# EAGLE design openSX70_MEROEC_V7-9C_20200625-TCS3200 (EAGLE 9.6.1)
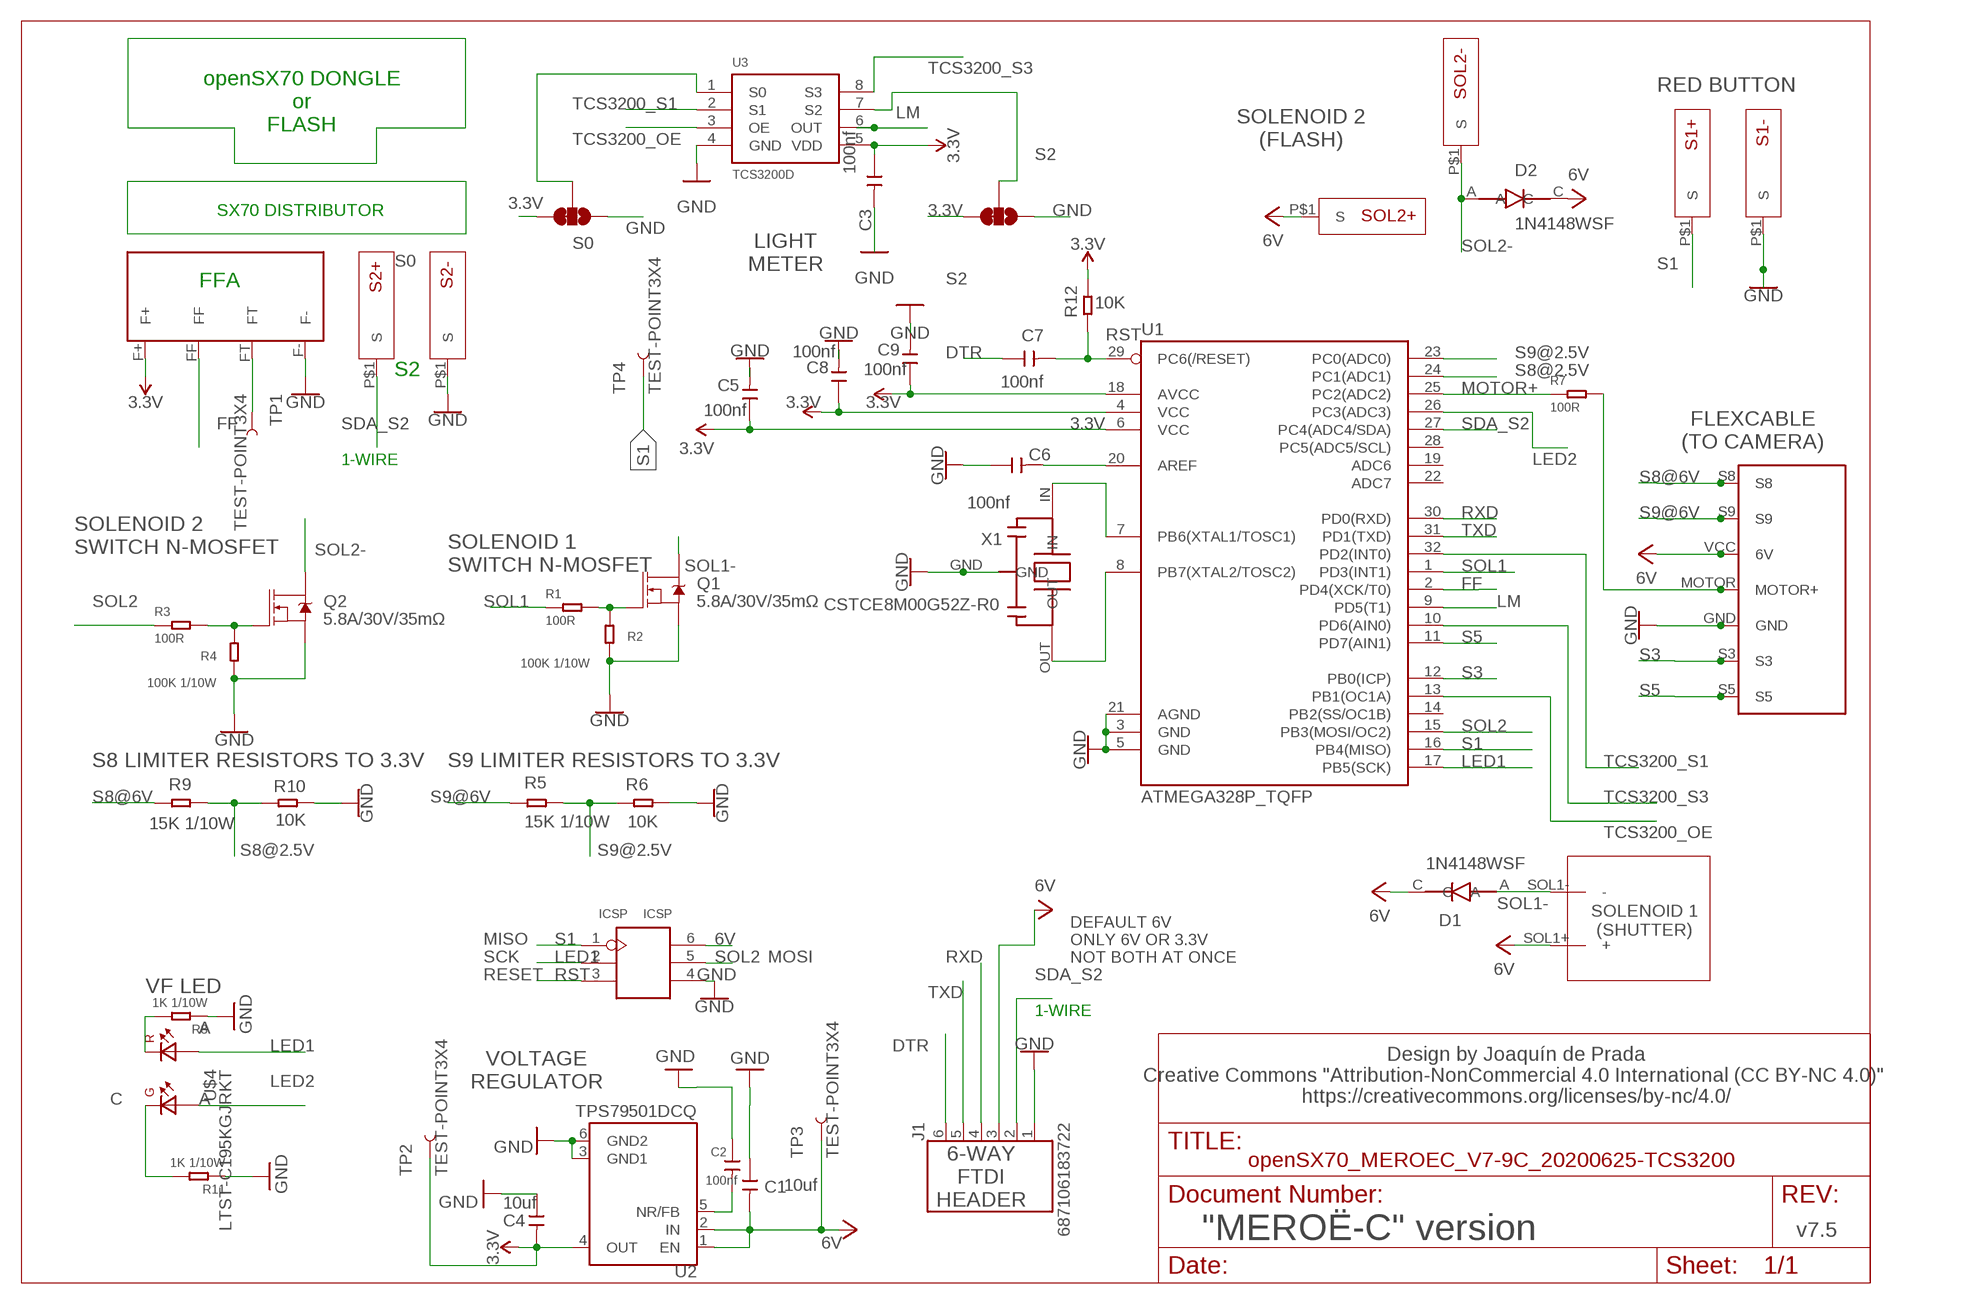
[diagram p0: schematic, sheet 1]

## Parts
C1  10uf  CERAMIC-10UF-10V-10%-X5R(0603)  [C0603]
C2  100nf  CERAMIC-100NF-50V-10%-X7R(0603)  [C0603]
C3  100nf  CERAMIC-100NF-50V-10%-X7R(0603)  [C0603]
C4  10uf  CERAMIC-10UF-10V-10%-X5R(0603)  [C0603]
C5  100nf  CERAMIC-100NF-50V-10%-X7R(0603)  [C0603]
C6  100nf  CERAMIC-100NF-50V-10%-X7R(0603)  [C0603]
C7  100nf  CERAMIC-100NF-50V-10%-X7R(0603)  [C0603]
C8  100nf  CERAMIC-100NF-50V-10%-X7R(0603)  [C0603]
C9  100nf  CERAMIC-100NF-50V-10%-X7R(0603)  [C0603]
D1  1N4148WSF  1N4148WS  [SODFL2512X100N]
D2  1N4148WSF  1N4148WS  [SODFL2512X100N]
ICSP  ICSP  [H2X3-2.54]
J1  687106183722  [687106183722]
Q1  5.8A/30V/35mΩ  MOSFET-NCH-AO3404A  [SOT23-3]
Q2  5.8A/30V/35mΩ  MOSFET-NCH-AO3404A  [SOT23-3]
R1  100R  SMD-RES-100R-5%-1/10W(0603)  [R0603]
R2  100K 1/10W  SMD-RES-100K-5%-1/10W(0603)  [R0603]
R3  100R  SMD-RES-100R-5%-1/10W(0603)  [R0603]
R4  100K 1/10W  SMD-RES-100K-5%-1/10W(0603)  [R0603]
R5  15K 1/10W  SMD-RES-15K-1%-1/10W(0603)  [R0603]
R6  10K  SMD-RES-10K-1%-1/10W(0603)  [R0603]
R7  100R  SMD-RES-100R-5%-1/10W(0603)  [R0603]
R8  1K 1/10W  SMD-RES-1K-5%-1/10W(0603)  [R0603]
R9  15K 1/10W  SMD-RES-15K-1%-1/10W(0603)  [R0603]
R10  10K  SMD-RES-10K-1%-1/10W(0603)  [R0603]
R11  1K 1/10W  SMD-RES-1K-5%-1/10W(0603)  [R0603]
R12  10K  SMD-RES-10K-1%-1/10W(0603)  [R0603]
S0  S0  JUMPER-SMT_3_1-NC_TRACE_SILK  [SMT-JUMPER_3_1-NC_TRACE_SILK]
S1+  SX70-S-PAD-NEW  [SX70-S-PAD2]
S1-  SX70-S-PAD-NEW  [SX70-S-PAD2]
S2  S2  JUMPER-SMT_3_1-NC_TRACE_SILK  [SMT-JUMPER_3_1-NC_TRACE_SILK]
S2+  SX70-S-PAD-NEW  [SX70-S-PAD2]
S2-  SX70-S-PAD-NEW  [SX70-S-PAD2]
SOL1  SX70-SOLENOID1-2PADS  [SX70-SOLENOID1-2]
SOL2+  SX70-S-PAD-NEW  [SX70-S-PAD2]
SOL2-  SX70-S-PAD-NEW  [SX70-S-PAD2]
TP1  TEST-POINT3X4  [PAD.03X.04]
TP2  TEST-POINT3X4  [PAD.03X.04]
TP3  TEST-POINT3X4  [PAD.03X.04]
TP4  TEST-POINT3X4  [PAD.03X.04]
U1  ATMEGA328P_TQFP  [TQFP32-08]
U2  TPS79501DCQ  [SOT127P706X180-6N]
U3  TCS3200D  [SOIC8]
U$1  SX70-7-PAD  [SX70-7-PAD-PROPER]
U$2  FFA  SX70-FFA-PAD  [FFA-PAD-PACKAGE]
U$4  LTST-C195KGJRKT  [LTST-BILED-15X16]
X1  CSTCE8M00G52Z-R0  CSTCE16M0V53-R0  [CFP95P160X100-3N]

## Nets
3.3V: C3.1 C4.2 C5.1 C8.1 C9.1 R12.2 S0.3 S2.3 TP2.P$1 U1.4(VCC) U1.6(VCC) U1.18(AVCC) U2.4(OUT) U3.5(VDD) U$2.F+
6V: C1.2 D1.C D2.C ICSP.6(VCC) J1.3 SOL1.SOL1+(+) SOL2+.P$1(S) TP3.P$1 U2.1(EN) U2.2(IN) U$1.VCC(6V)
DTR: C7.1 J1.6
FF: U1.2(PD4(XCK/T0)) U$2.FF
GND: C1.1 C2.1 C3.2 C4.1 C5.2 C6.1 C8.2 C9.2 ICSP.4(GND) J1.1 Q1.2(S) Q2.2(S) R2.1 R4.1 R6.2 R8.1 R10.2 R11.1 S0.1 S1-.P$1(S) S2-.P$1(S) S2.1 U1.3(GND) U1.5(GND) U1.21(AGND) U2.3(GND1) U2.6(GND2) U3.4(GND) U$1.GND U$2.F- X1.GND
LED1: ICSP.2(SCK) U1.17(PB5(SCK)) U$4.P$2(A2)
LED2: U1.26(PC3(ADC3)) U$4.P$1(A1)
LM: U1.9(PD5(T1)) U3.6(OUT)
MOTOR+: R7.1 U1.25(PC2(ADC2))
MOTOR-HEADER: R7.2 U$1.MOTOR(MOTOR+)
N$1: Q1.1(G) R1.2 R2.2
N$2: C6.2 U1.20(AREF)
N$3: Q2.1(G) R3.2 R4.2
N$4: U1.7(PB6(XTAL1/TOSC1)) X1.IN
N$5: TP1.P$1 U$2.FT
N$6: U1.8(PB7(XTAL2/TOSC2)) X1.OUT
N$7: S0.2 U3.1(S0)
N$8: S2.2 U3.7(S2)
N$9: R8.2 U$4.P$4(K2)
N$10: C2.2 U2.5(NR/FB)
N$11: R11.2 U$4.P$3(K1)
RST: C7.2 ICSP.3(RST) R12.1 U1.29(PC6(/RESET))
RXD: J1.4 U1.30(PD0(RXD))
S1: ICSP.1(MISO) S1+.P$1(S) TP4.P$1 U1.16(PB4(MISO))
S3: U1.12(PB0(ICP)) U$1.S3
S5: U1.11(PD7(AIN1)) U$1.S5
S8@2.5V: R9.2 R10.1 U1.24(PC1(ADC1))
S8@6V: R9.1 U$1.S8
S9@2.5V: R5.2 R6.1 U1.23(PC0(ADC0))
S9@6V: R5.1 U$1.S9
SDA_S2: J1.2 S2+.P$1(S) U1.27(PC4(ADC4/SDA))
SOL1: R1.1 U1.1(PD3(INT1))
SOL1-: D1.A Q1.3(D) SOL1.SOL1-(-)
SOL2: ICSP.5(MOSI) R3.1 U1.15(PB3(MOSI/OC2))
SOL2-: D2.A Q2.3(D) SOL2-.P$1(S)
TCS3200_OE: U1.13(PB1(OC1A)) U3.3(OE)
TCS3200_S1: U1.32(PD2(INT0)) U3.2(S1)
TCS3200_S3: U1.10(PD6(AIN0)) U3.8(S3)
TXD: J1.5 U1.31(PD1(TXD))
Unconnected: U1.14(PB2(SS/OC1B)) U1.19(ADC6) U1.22(ADC7) U1.28(PC5(ADC5/SCL))

## Notes on the sheet
- RED BUTTON
- openSX70 DONGLE
  or
  FLASH
- SOLENOID 2
  (FLASH)
- SX70 DISTRIBUTOR
- LIGHT
  METER
- FFA
- S2
- FLEXCABLE
  (TO CAMERA)
- 1-WIRE
- SOLENOID 2
  SWITCH N-MOSFET
- SOLENOID 1
  SWITCH N-MOSFET
- S8 LIMITER RESISTORS TO 3.3V | S9 LIMITER RESISTORS TO 3.3V
- SOLENOID 1
  (SHUTTER)
- MISO
- SCK | MOSI
- RESET
- DEFAULT 6V
  ONLY 6V OR 3.3V
  NOT BOTH AT ONCE
- VF LED | 1-WIRE
- A
- VOLTAGE
  REGULATOR
- Design by Joaquín de Prada
  Creative Commons "Attribution-NonCommercial 4.0 International (CC BY-NC 4.0)" 
  https://creativecommons.org/licenses/by-nc/4.0/
- C | A
- 6-WAY
  FTDI
  HEADER
- v7.5
- "MEROË-C" version

## Library data of the parts
C1 C4 = Seeed-Capacitor:CERAMIC-10UF-10V-10%-X5R(0603): 302010103; MPN: CC0603KRX5R6BB106
C2 C3 C5-C9 = Seeed-Capacitor:CERAMIC-100NF-50V-10%-X7R(0603): 302010138; MPN: CC0603KRX7R9BB104
D1 D2 = Common-Parts-Library-Eagle:1N4148WS: 1N4148WS Series 75 V 300 mA Surface Mount Small Signal Diodes - SOD-323F; MANUFACTURER: Fairchild Semiconductor
ICSP = openSX70:ICSP
J1 = 687106183722:687106183722: 687106183722 WR-FPC 0.50mm SMT Horizontal Bottom Contact - Low Profile <http://katalog.we-online.de/media/images/v2/Family_WR-FPC_6871xx183722.jpg> Details see: http://katalog.we-online.de/en/em/FPC_0_5_SMT_ZIF_HORIZONTAL_BOTTOM_CONTACT_LOW_PROFILE_6871xx183722 Created by Yingchun,shan 2016 (C) Wurth Elektronik; AVAILABILITY: Good; DESCRIPTION: CONN FFC BTM 6POS 0.5MM SMD R/A; MF: Wurth Electronics; MP: 687106183722; PACKAGE: None; PRICE: 1.21 USD
Q1 Q2 = openSX70:MOSFET-NCH: N-channel MOSFETs Voltage controlled devices that allow control of high current outputs. SparkFun Products: SparkFun OpenScale <https://www.sparkfun.com/products/13261> SparkFun Digital Sandbox <https://www.sparkfun.com/products/12651> SparkFun Monster Moto Shield <https://www.sparkfun.com/products/10182> SparkFun MOSFET Power Controller <https://www.sparkfun.com/products/11214>; PROD_ID: TRANS-12988
R1 R3 R7 = Seeed-Resistor:SMD-RES-100R-5%-1/10W(0603): 301010090; MPN: RC0603JR-07100RL
R2 R4 = Seeed-Resistor:SMD-RES-100K-5%-1/10W(0603): 301010089; MPN: RC0603JR-07100KL
R5 R9 = Seeed-Resistor:SMD-RES-15K-1%-1/10W(0603): 301010241; MPN: RC0603FR-0715KL
R6 R10 R12 = Seeed-Resistor:SMD-RES-10K-1%-1/10W(0603): 301010299; MPN: RC0603FR-0710KL
R8 R11 = Seeed-Resistor:SMD-RES-1K-5%-1/10W(0603): 301010291; MPN: RC0603JR-071KL
S0 S2 = SparkFun-Jumpers:JUMPER-SMT_3_1-NC_TRACE: Normally closed trace jumper (1 of 2 connections) This jumper has a trace between two pads so it's normally closed (NC). The other connection is normally open (NO). Use a razor knife to open the connection. For best results follow the IPC guidelines for cutting traces: Cutout at least 0.063 mm (0.005 in). Remove all loose material to clean up the cut area. Seal the cut with an approved epoxy. Reapply solder to reclose the connection, or to close the NO connection.
S1+ S1- S2+ S2- SOL2+ SOL2- = openSX70:SX70-S-PAD-NEW
SOL1 = openSX70:SX70-SOLENOID1-2PADS
TP1-TP4 = SparkFun-Connectors:TEST-POINT: SparkFun Test Points Bare copper test points for troubleshooting or In-Circuit-Testing. These are used by our Production team for verifying production board runs using pogo-pins on test beds. SparkFun Products: SparkFun LSM9DS1 Breakout <https://www.sparkfun.com/products/13284> SparkFun PSOC <https://www.sparkfun.com/products/13714> SparkFun Load Cell Amplifier <https://www.sparkfun.com/products/13879>
U1 = openSX70:ATMEGA328P_TQFP: Popular 328P in QFP Storefront component: ATmega328 - TQFP <https://www.sparkfun.com/products/13448> (COM-13448) Datasheet <http://www.sparkfun.com/datasheets/Components/SMD/ATMega328.pdf> SparkFun Products SparkFun RedBoard - Programmed with Arduino <https://www.sparkfun.com/products/12757> (DEV-12757) Arduino Pro Mini 328 - 5V/16MHz <https://www.sparkfun.com/products/11113> (DEV-11113) Arduino Pro Mini 328 - 3.3V/8MHz <https://www.sparkfun.com/products/11114> (DEV-11114) SparkFun OpenLog <https://www.sparkfun.com/products/13712> (DEV-13712) SparkFun MicroView - OLED Arduino Module <https://www.sparkfun.com/products/12923> (DEV-12923) SparkFun Digital Sandbox <https://www.sparkfun.com/products/12651> (DEV-12651) SparkFun PicoBoard <https://www.sparkfun.com/products/11888> (WIG-11888) Arduino Fio <https://www.sparkfun.com/products/10116> (DEV-10116) LilyPad Arduino 328 Main Board <https://www.sparkfun.com/products/13342> (DEV-13342) SparkFun RedStick <https://www.sparkfun.com/products/13741> (DEV-13741) LilyPad MP3 <https://www.sparkfun.com/products/11013> (DEV-11013) LilyPad Arduino SimpleSnap <https://www.sparkfun.com/products/10941> (DEV-10941) SparkFun Stepoko <https://www.sparkfun.com/products/13899> (ROB-13899) SparkFun Geiger Counter <https://www.sparkfun.com/products/11345> (SEN-11345) SparkFun EL Sequencer <https://www.sparkfun.com/products/12781> (COM-12781) Arduino Pro 328 - 5V/16MHz <https://www.sparkfun.com/products/10915> (DEV-10915) CryptoCape <https://www.sparkfun.com/products/12773> (DEV-12773) SparkFun IR Thermometer Evaluation Board - MLX90614 <https://www.sparkfun.com/products/10740> (SEN-10740) SparkFun RedBot Mainboard <https://www.sparkfun.com/products/12097> (ROB-12097) Arduino Pro 328 - 3.3V/8MHz <https://www.sparkfun.com/products/10914> (DEV-10914) SparkFun Block for Intel® Edison - Arduino <https://www.sparkfun.com/products/13036> (DEV-13036) SparkFun Simon Says - Surface Mount Soldering Kit <https://www.sparkfun.com/products/10935> (KIT-10935) SparkFun 7-Segment Serial Display - Red <https://www.sparkfun.com/products/11441> (COM-11441) SparkFun 7-Segment Serial Display - White <https://www.sparkfun.com/products/11629> (COM-11629) SparkFun 7-Segment Serial Display - Yellow <https://www.sparkfun.com/products/11443> (COM-11443) SparkFun 7-Segment Serial Display - Kelly Green <https://www.sparkfun.com/products/11440> (COM-11440) SparkFun 7-Segment Serial Display - Blue <https://www.sparkfun.com/products/11442> (COM-11442) SparkFun OpenSegment Serial Display - 20mm (Blue) <https://www.sparkfun.com/products/11647> (COM-11647) SparkFun OpenSegment Serial Display - 20mm (Green) <https://www.sparkfun.com/products/11646> (COM-11646) SparkFun OpenSegment Serial Display - 20mm (White) <https://www.sparkfun.com/products/11648> (COM-11648) SparkFun OpenSegment Serial Display - 20mm (Red) <https://www.sparkfun.com/products/11644> (COM-11644) SparkFun OpenSegment Serial Display - 20mm (Yellow) <https://www.sparkfun.com/products/11645> (COM-11645) SparkFun OpenSegment Shield <https://www.sparkfun.com/products/13190> (DEV-13190); PROD_ID: IC-09069
U2 = TPS79501DCQ:TPS79501DCQ: Ultralow-Noise, High-PSRR, Fast, RF, 500-mA Low-Dropout Linear Regulators 6-SOT-223 -40 to 125; AVAILABILITY: Unavailable; DESCRIPTION: Ultralow-Noise, High-PSRR, Fast, RF, 500-mA Low-Dropout Linear Regulators 6-SOT-223 -40 to 125; MF: Texas Instruments; MP: TPS79501DCQ; PACKAGE: SOT-223-6 Texas Instruments; PRICE: None
U3 = TCS3200D:TCS3200D; AVAILABILITY: Unavailable; DESCRIPTION: TSL3200 Series 5.5 V Programmable Color Light-To-Frequency Converter - SOIC-8; MF: ams; MP: TCS3200D-TR; PACKAGE: SOIC-8 ams; PRICE: None
U$1 = _openSX70:SX70-7-PAD
U$2 = _openSX70:SX70-FFA-PAD
U$4 = LTST-C195KGJRKT:LTST-C195KGJRKT; AVAILABILITY: Unavailable; DESCRIPTION: Green/Red 130° Water Clear 35/25 mcd 2 V 0605 Surface Mount Bi-Color LED; MF: Lite-On Inc.; MP: LTST-C195KGJRKT; PACKAGE: 0606 Lite-On; PRICE: None
X1 = CSTCE16M0V53-R0:CSTCE16M0V53-R0: Ceramic Resonator 16MHz ±0.5% (Tol) ±0.3% (Stability) 15pF 40Ohm 3-Pin CSMD T/R; AVAILABILITY: Good; DESCRIPTION: Ceramic Resonator 16MHz ??0.5% (Tol) ??0.3% (Stability) 15pF 40Ohm 3-Pin CSMD T/R; MF: Murata; MP: CSTCE16M0V53-R0; PACKAGE: SMD-3 Murata; PRICE: 0.28 USD

## Net classes
0 default: width 0.254 mm
1 GND: width 0.61 mm

## Board
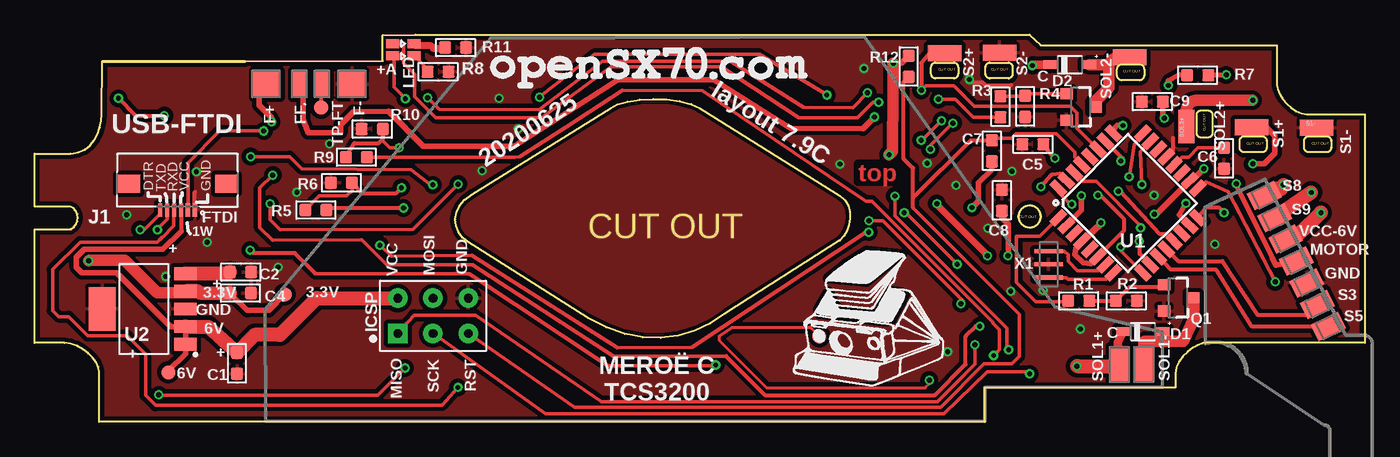
[diagram p1: board, top side]
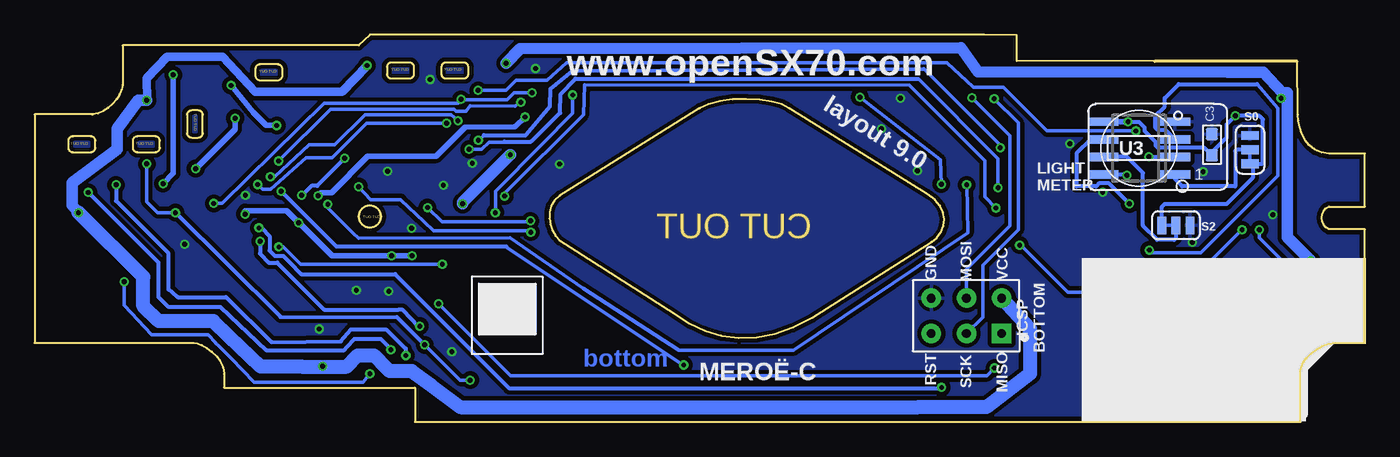
[diagram p2: board, bottom side, seen from below]

Size 95.88 x 27.9 mm. Coordinates in mm from the lower left corner, seen from the top.
Outline: 71.72,15.6 71.88,15.58 72.03,15.53 72.17,15.46 72.29,15.36 72.39,15.24 72.46,15.11 72.51,14.96 72.52,14.8
Outline: 72.52,14.8 72.51,14.63 72.46,14.48 72.39,14.35 72.29,14.23 72.17,14.13 72.03,14.06 71.88,14.01 71.72,14
Outline: 71.72,14 71.56,14.01 71.41,14.06 71.28,14.13 71.16,14.23
Outline: 71.16,14.23 71.06,14.35 70.99,14.48 70.94,14.63 70.92,14.8
Outline: 70.92,14.8 70.94,14.96 70.99,15.11 71.06,15.24 71.16,15.36
Outline: 71.16,15.36 71.28,15.46 71.41,15.53 71.56,15.58 71.72,15.6
Outline: 71.72,15.6 71.57,15.58 71.42,15.53 71.28,15.46 71.16,15.36
Outline: 71.16,15.36 71.06,15.24 70.98,15.1 70.94,14.95 70.92,14.8
Outline: 70.92,14.8 70.94,14.64 70.98,14.49 71.06,14.35 71.16,14.23
Outline: 71.16,14.23 71.28,14.13 71.42,14.06 71.57,14.01 71.72,14
Outline: 71.72,14 71.88,14.01 72.03,14.06 72.17,14.13 72.29,14.23 72.39,14.35 72.46,14.49 72.51,14.64 72.52,14.8
Outline: 72.52,14.8 72.51,14.95 72.46,15.1 72.39,15.24 72.29,15.36 72.17,15.46 72.03,15.53 71.88,15.58 71.72,15.6
Outline: 91.7,22.16 91.77,22.16 95.88,22.16 95.88,5.69 84.4,5.69 84.15,5.65 83.83,5.52 83.48,5.33 83.11,5.06 82.78,4.73 82.5,4.35 82.31,3.92 82.24,3.45 82.24,2.46 68.48,2.46 68.48,0 4.65,0 4.65,3.66 4.59,3.95 4.43,4.28 4.17,4.61 3.85,4.94 3.46,5.24 3.04,5.47 2.59,5.63 2.14,5.69 0,5.69 0,13.87 2.59,13.89 2.81,14.01 2.98,14.2 3.07,14.44 3.1,14.7 3.07,14.96 2.97,15.2 2.81,15.39 2.59,15.51 0,15.51 0,19.34 2.59,19.34 3.14,19.41 3.6,19.61 3.99,19.92 4.3,20.31 4.53,20.75 4.7,21.22 4.79,21.7 4.82,22.16 4.87,25.98 15.15,25.98 15.1,25.99 25.09,26 25.09,27.86 27.43,27.9 71.71,27.9 72.52,27.12 89.55,27.12 89.55,24.26 89.61,23.95 89.76,23.61 89.97,23.26 90.25,22.93 90.57,22.62 90.93,22.38 91.31,22.22 91.7,22.16
Outline: 83.76,20.82 83.76,22.11 83.77,22.17 83.79,22.24 83.82,22.29 83.86,22.34 83.91,22.38 83.96,22.41 84.03,22.43 84.09,22.44 84.57,22.44 84.64,22.43 84.7,22.41 84.76,22.38 84.81,22.34 84.85,22.29 84.88,22.24 84.9,22.17 84.9,22.11 84.9,20.82 84.9,20.75 84.88,20.69 84.85,20.63 84.81,20.58 84.76,20.54 84.7,20.51 84.64,20.49 84.57,20.49 84.09,20.49 84.03,20.49 83.96,20.51 83.91,20.54 83.86,20.58 83.82,20.63 83.79,20.69 83.77,20.75 83.76,20.82
Outline: 87.19,20.58 88.48,20.58 88.54,20.57 88.61,20.55 88.66,20.52 88.71,20.48 88.75,20.43 88.78,20.37 88.8,20.31 88.81,20.24 88.81,19.77 88.8,19.7 88.78,19.64 88.75,19.58 88.71,19.53 88.66,19.49 88.61,19.46 88.54,19.44 88.48,19.43 87.19,19.43 87.12,19.44 87.06,19.46 87,19.49 86.95,19.53 86.91,19.58 86.88,19.64 86.86,19.7 86.86,19.77 86.86,20.24 86.86,20.31 86.88,20.37 86.91,20.43 86.95,20.48 87,20.52 87.06,20.55 87.12,20.57 87.19,20.58
Outline: 91.84,20.58 93.13,20.58 93.2,20.57 93.26,20.55 93.32,20.52 93.37,20.48 93.41,20.43 93.44,20.37 93.46,20.31 93.46,20.24 93.46,19.77 93.46,19.7 93.44,19.64 93.41,19.58 93.37,19.53 93.32,19.49 93.26,19.46 93.2,19.44 93.13,19.43 91.84,19.43 91.78,19.44 91.71,19.46 91.66,19.49 91.61,19.53 91.57,19.58 91.54,19.64 91.52,19.7 91.51,19.77 91.51,20.24 91.52,20.31 91.54,20.37 91.57,20.43 91.61,20.48 91.66,20.52 91.71,20.55 91.78,20.57 91.84,20.58
Outline: 78.36,25.76 79.65,25.76 79.71,25.75 79.78,25.73 79.83,25.7 79.88,25.66 79.92,25.61 79.95,25.55 79.97,25.49 79.98,25.43 79.98,24.95 79.97,24.88 79.95,24.82 79.92,24.76 79.88,24.71 79.83,24.67 79.78,24.64 79.71,24.62 79.65,24.61 78.36,24.61 78.29,24.62 78.23,24.64 78.17,24.67 78.12,24.71 78.08,24.76 78.05,24.82 78.03,24.88 78.02,24.95 78.02,25.43 78.03,25.49 78.05,25.55 78.08,25.61 78.12,25.66 78.17,25.7 78.23,25.73 78.29,25.75 78.36,25.76
Outline: 68.87,25.89 70.16,25.89 70.23,25.88 70.29,25.86 70.35,25.83 70.39,25.79 70.44,25.74 70.47,25.68 70.49,25.62 70.49,25.56 70.49,25.08 70.49,25.01 70.47,24.95 70.44,24.89 70.39,24.84 70.35,24.8 70.29,24.77 70.23,24.75 70.16,24.74 68.87,24.74 68.8,24.75 68.74,24.77 68.69,24.8 68.64,24.84 68.6,24.89 68.56,24.95 68.55,25.01 68.54,25.08 68.54,25.56 68.55,25.62 68.56,25.68 68.6,25.74 68.64,25.79 68.69,25.83 68.74,25.86 68.8,25.88 68.87,25.89
Outline: 64.95,25.89 66.24,25.89 66.31,25.88 66.37,25.86 66.43,25.83 66.48,25.79 66.52,25.74 66.55,25.68 66.57,25.62 66.57,25.56 66.57,25.08 66.57,25.01 66.55,24.95 66.52,24.89 66.48,24.84 66.43,24.8 66.37,24.77 66.31,24.75 66.24,24.74 64.95,24.74 64.89,24.75 64.82,24.77 64.77,24.8 64.72,24.84 64.68,24.89 64.65,24.95 64.63,25.01 64.62,25.08 64.62,25.56 64.63,25.62 64.65,25.68 64.68,25.74 64.72,25.79 64.77,25.83 64.82,25.86 64.89,25.88 64.95,25.89
Outline: 31.52,16.4 41.5,22.59 42.01,22.87 42.74,23.08 43.62,23.21 44.59,23.26 45.57,23.23 46.5,23.11 47.32,22.89 47.96,22.59 58.05,16.28 58.41,15.95 58.64,15.56 58.77,15.12 58.78,14.66 58.71,14.21 58.56,13.78 58.34,13.39 58.06,13.08 49.78,7.82 48.71,7.1 47.57,6.56 46.38,6.21 45.13,6.05 43.85,6.08 42.53,6.33 41.2,6.8 39.87,7.5 31.22,12.98 30.83,13.28 30.55,13.67 30.37,14.11 30.32,14.6 30.4,15.09 30.62,15.57 30.99,16.02 31.52,16.4
Copper layers (1*16): Top 0.035mm / dielectric 1.5mm / Bottom 0.035mm
Design rules "SeeedStudio_2layer_DRU_no_angle_20140221": minimum track width 6mil, minimum drill 12mil, track to track 6mil, track to pad 6mil, pad to pad 6mil, via to via 6mil, smd to smd 0mil, copper to edge 10mil, drill to drill 10mil, minimum pad ring 10mil, minimum via ring 6mil, stop-mask expansion 2mil, vias tented up to drill 100mil, thermal gap 10mil
tRestrict: area 57.1,10.1 to 62.5,12.4; area 56.4,7.2 to 62.7,9.5

### Footprints (pad centres in the part's own frame; a part is rotated, then mirrored left to right if it is on the bottom)
C0603 = smd 0.889 x 0.889: 1 0,0.762; 2 0,-0.762
SODFL2512X100N = smd 1.05 x 0.6: A 1.4,0; C -1.4,0
H2X3-2.54 = drill 0.635 pad 1.397 square: 1 -1.27,2.54 | drill 0.635 pad 1.397: 2 -1.27,0; 3 -1.27,-2.54; 4 1.27,-2.54; 5 1.27,0; 6 1.27,2.54
687106183722 = smd 0.3 x 1: 1 -1.25,1.9; 2 -0.75,1.9; 3 -0.25,1.9; 4 0.25,1.9; 5 0.75,1.9; 6 1.25,1.9 | smd 1.65 x 1.3: Z1 -3.525,0; Z2 3.525,0
SOT23-3 = smd 0.8 x 0.9: 1 -0.95,-1; 2 0.95,-1; 3 0,1.1
R0603 = smd 0.889 x 0.889: 1 0,0.762; 2 0,-0.762
SMT-JUMPER_3_1-NC_TRACE_SILK = smd 0.635 x 1.27: 1 -1.016,0; 2 0,0; 3 1.016,0
SX70-S-PAD2 = smd 2.413 x 1.143: P$1 0.01,0.087
SX70-SOLENOID1-2 = smd 1.372 x 2.54: SOL1+ -0.826,0.127; SOL1- 0.953,0.127
PAD.03X.04 = smd 1.016 x 1.016: P$1 0,0
TQFP32-08 = smd 1.27 x 0.559: 1 -4.293,2.8; 2 -4.293,2; 3 -4.293,1.2; 4 -4.293,0.4; 5 -4.293,-0.4; 6 -4.293,-1.2; 7 -4.293,-2; 8 -4.293,-2.8; 17 4.293,-2.8; 18 4.293,-2; 19 4.293,-1.2; 20 4.293,-0.4; 21 4.293,0.4; 22 4.293,1.2; 23 4.293,2; 24 4.293,2.8 | smd 0.559 x 1.27: 9 -2.8,-4.293; 10 -2,-4.293; 11 -1.2,-4.293; 12 -0.4,-4.293; 13 0.4,-4.293; 14 1.2,-4.293; 15 2,-4.293; 16 2.8,-4.293; 25 2.8,4.293; 26 2,4.293; 27 1.2,4.293; 28 0.4,4.293; 29 -0.4,4.293; 30 -1.2,4.293; 31 -2,4.293; 32 -2.8,4.293
SOT127P706X180-6N = smd 0.92 x 1.61: 1 -2.54,-3.005; 2 -1.27,-3.005; 3 0,-3.005; 4 1.27,-3.005; 5 2.54,-3.005 | smd 3.16 x 1.97: 6 0,3.005
SOIC8 = smd 2.2 x 0.6: 1 -2.6,1.905; 2 -2.6,0.635; 3 -2.6,-0.635; 4 -2.6,-1.905; 5 2.6,-1.905; 6 2.6,-0.635; 7 2.6,0.635; 8 2.6,1.905
SX70-7-PAD-PROPER = smd 1.31 x 2.159: GND 7.875,1.312; MOTOR 6.125,1.312; S3 9.625,1.312; S5 11.375,1.312; S8 0.875,1.312; S9 2.625,1.312; VCC 4.375,1.312
FFA-PAD-PACKAGE = smd 1.95 x 1.95: F+ -3.277,-0.013; F- 2.87,0 | smd 1.05 x 1.95: FF -0.914,0; FT 0.737,0.025
LTST-BILED-15X16 = smd 0.65 x 0.952: P$1 0.425,0.776; P$2 -0.425,0.776; P$3 0.425,-0.776; P$4 -0.425,-0.776
CFP95P160X100-3N = smd 0.3 x 2.032: GND 0.038,0.175; IN -0.912,0.177; OUT 0.992,0.174

### Placement (x,y rotation side)
C1  14.58,4.23 180 top
C2  14.84,10.79 270 top
C3  11.02,19.97 180 bottom
C4  14.83,9.28 270 top
C5  71.96,20 270 top
C6  85.74,18.99 180 top
C7  69,19.53 180 top
C8  69.72,15.96 180 top
C9  80.57,23.07 270 top
D1  79.88,6.51 0 top
D2  74.62,25.74 0 top
ICSP  28.71,7.64 90 top
J1  10.3,17.17 180 top
Q1  82.41,8.94 270 top
Q2  75.39,22.69 270 top
R1  75.26,8.72 90 top
R2  78.69,8.72 270 top
R3  69.61,22.71 180 top
R4  71.4,22.73 180 top
R5  20.27,15.26 270 top
R6  22.11,17.23 270 top
R7  83.83,24.98 90 top
R8  29.08,25.23 270 top
R9  23.19,19.07 270 top
R10  24.33,21.1 270 top
R11  30.34,26.97 270 top
R12  63,25.61 180 top
S0  8.28,19.62 270 bottom
S1+  87.7,21.14 0 top
S1-  92.39,21.09 0 top
S2  13.61,14.16 180 bottom
S2+  65.6,26.46 0 top
S2-  69.53,26.51 0 top
SOL1  79.01,4.05 0 top
SOL2+  83.11,21.28 90 top
SOL2-  78.93,26.19 0 top
TP1  20.65,22.64 0 top
TP2  18.03,9.18 0 top
TP3  9.63,3.56 0 top
TP4  56.57,6.15 0 top
U1  78.82,15.77 45 top
U2  7.87,8.14 90 top
U3  16.28,19.72 180 bottom
U$1  87.07,16.52 296 top
U$2  20.01,24.34 0 top
U$4  26.57,26.8 90 top
X1  72.91,11.39 270 top

### Tracks (layer width: path | path; a pad name or v marks a point on that pad's centre or on a via)
3.3V  (via drill 0.35)
  Top 0.254: 76.13,11.39 U1.6
  Top 0.305: U1.6 78.51,13.77 78.51,14.64 76.83,16.32 v76.63,16.32 | C5.1 72.72,19.85 73.56,19.01 v73.53,18.98 | v6.04,23.31 7.29,22.06 v9.35,22.06
  Top 0.406: U1.4 75.05,12.51 74.99,12.04 75.58,11.45 76.13,11.39 | R12.2 62.48,25.85 v61.91,25.85 | C4.2 15.33,8.02 16.89,8.03 TP2.P$1 18.24,9.38 | U$2.F+ 16.18,23.77 16.18,22.82 17.07,21.93 v17.07,21.62 | v84.28,18.25 83.42,17.39 U1.18 80.84,14.97 v80.72,14.97 | v81.43,21.88 81.33,21.98 C9.1 | v70.16,11.97 70.18,12 70.18,14.23 69.72,14.69 C8.1
  Top 0.508: U1.4 76.81,14.25 v76.85,14.35 | v65.04,15.72 65.04,15.65 68.68,12 v68.68,11.97
  Top 0.813: v61.6,19.25 61.85,19.5 61.85,19.52 61.88,23.74 61.88,25.83 v61.91,25.85 | v61.6,19.25 | 11.89,9.3 8.84,9.3 6.5,11.65 3.91,11.65 v3.89,11.62
  Top 1.016: U2.4 11.78,9.41 11.89,9.3 C4.2
  Bottom 0.254: v6.04,23.31 5.63,23.72 5.58,23.72
  Bottom 0.305: 17.25,21.62 v17.07,21.62 16.28,21.62 15.88,21.22 15.88,20.97 15.09,20.17 15.09,19.93 14.91,19.75 11.56,19.75 C3.1 11.02,19.41 9.98,20.46 9.98,21.42 v9.35,22.06 7.59,22.06 7.34,21.8 7.34,18.6 S0.3 8.08,18.4 8.08,17.59 9.96,15.71 14.43,15.71 14.63,15.5 S2.3 | v73.53,18.98 75.51,17 75.92,17 76.63,16.29 v76.63,16.32
  Bottom 0.406: v80.72,14.97 80.72,15.22 77.72,15.22 v76.85,14.35 76.83,14.35 74.45,11.97 v70.16,11.97 v68.68,11.97 | v84.28,18.25 81.43,21.09 v81.43,21.88 | v17.07,21.62 U3.5
  Bottom 0.813: v61.91,25.85 60.9,26.87 29.13,26.94 27.89,25.21 9.87,25.19 9.85,25.18 7.33,25.18 5.94,23.72 5.58,23.72 5.58,13.31 v3.89,11.62 | v65.04,15.72 65.04,15.82 v61.6,19.25
6V  (via drill 0.35)
  Top 0.254: 87.77,23.17 v87.82,23.17
  Top 0.305: J1.3 10.55,13.73
  Top 0.406: TP3.P$1 9.63,3.67 10.88,4.92 U2.1 U2.2 9.8,6.87 5.91,10.76 3.39,10.76 3,11.15 3,11.84 3.58,12.43 9.24,12.43 10.55,13.73
  Top 0.61: v71.93,25.68 arc-90 71.99,25.74 D2.C | SOL1.SOL1+ 78.09,5.74 D1.C
  Top 0.813: SOL2+.P$1 83.03,22.42 arc-90 83.77,23.17 87.77,23.17
  Top 1.016: v75.13,4.01 77.93,4.02 SOL1.SOL1+ | v92.72,15.07 92.7,15.07 91.29,13.7 U$1.VCC | ICSP.6 20.33,8.91 17.68,6.26 15.85,6.26 C1.2 12.51,6.84 U2.2
  Bottom 0.254: v87.82,23.17 87.93,23.17 87.77,23.17
  Bottom 0.61: v71.93,25.68 73.7,23.77 79.99,23.77 82.34,26.31 86.34,26.31 87.79,24.76 87.77,23.17
  Bottom 0.813: 86.69,7.26 86.94,7.26 | 76.66,3.98 v75.13,4.01 | v92.72,15.07 93.19,15.6 93.17,17.23 89.93,19.64 89.93,21.13 88.41,23.17 v87.82,23.17
  Bottom 1.016: 86.69,7.26 83.01,7.26 81.86,6.12 79.58,3.98 76.66,3.98 73.39,3.98 72.59,4.78 71.43,4.78 70.54,3.89 70.28,3.65 68.71,3.65 67.32,2.65 65.19,1.06 32.18,1.06 27.3,1.06 24.14,3.48 24.14,6.7 ICSP.6 | 86.94,7.26 88.05,8.34 88.05,10.44 v92.72,15.07
DTR  (via drill 0.35)
  Top 0.254: v26.69,3.88 24.72,1.91 8.97,1.92 v8.95,1.94 | 9.02,14.89 J1.6 9.05,15 7.9,13.85 v7.59,13.85 | v66.78,8.52 66.95,8.7 61.16,14.49 v60.15,14.49
  Top 0.406: C7.1 69,18.18 68.03,17.22 68.03,15.91 v67.57,15.44
  Bottom 0.254: v67.57,15.44 66.5,14.42 60.2,14.44 v60.15,14.49 | v26.69,3.88 27.24,3.34 61.59,3.34 v66.78,8.52 | v60.15,14.49 | v8.95,1.94 9.01,1.94 9.02,1.94 8.32,1.94 5.37,4.89 5.37,11.04 7.59,13.27 v7.59,13.85
FF  (via drill 0.35)
  Top 0.406: U$2.FF 19.35,24.09 19.35,21.81 19.7,20.84 22.05,20.84 22.05,21.42 22.99,22.36 25.51,22.37 28,19.87 34.25,19.87 34.55,19.87 42.06,24.65 48.93,24.66 54.48,21.15 59.7,21.11 v60.55,21.96 | v75.45,16.29 75.45,15.24 U1.2
  Bottom 0.406: v60.55,21.96 61.22,21.29 61.31,21.27 64.86,21.23 66.95,19.14 71.89,19.14 74.49,16.5 75.24,16.5 v75.45,16.29
GND  (via drill 0.35)
  Top 0.305: 82,19.52 U1.21 82.07,19.59 82.07,20.46 | J1.1 11.55,16.57 | v67.39,24.67 67.57,24.49 68.27,24.49 68.28,24.48 68.28,24.47 68.34,24.44 68.39,24.38 68.4,24.38 68.41,24.37 68.48,24.35 68.57,24.26 70.38,24.26 70.4,24.28
  Top 0.406: U1.21 81.57,19.11
  other vias: 75.39,6.69 72.69,9.48 59.77,25.46 33.48,23.33 18.9,16.54 32.26,18.09 34.85,21.12 6.63,14.92 80.69,16.31 66.42,17.05 68.71,13.95 65.81,5.06 85.06,12.78 21.26,20.05 70.36,9.41 12.45,12.94 9.45,10.47 64.34,18.63 70.43,18.07 17.55,11.13 11.66,18.02 58.04,18.58
  pour Top (isolate 0.305): 91.67,22.11 91.74,22.11 95.86,22.11 95.86,5.64 84.38,5.64 84.13,5.6 83.81,5.47 83.45,5.27 83.09,5.01 82.75,4.68 82.47,4.3 82.28,3.87 82.21,3.4 82.21,2.41 68.44,2.41 68.44,0 4.67,0 4.67,3.22 3.66,4.56 3.34,4.89 2.95,5.18 2.53,5.42 2.09,5.58 1.63,5.64 -0.03,5.64 -0.03,13.82 2.56,13.84 2.79,13.96 2.95,14.15 3.05,14.39 3.08,14.65 3.05,14.91 2.95,15.15 2.79,15.34 2.56,15.45 -0.03,15.46 -0.03,19.29 2.56,19.29 3.11,19.36 3.58,19.56 3.96,19.87 4.27,20.25 4.51,20.7 4.67,21.17 4.77,21.65 4.8,22.11 4.8,25.94 15.08,25.94 26.93,25.88 27,27.86 71.68,27.86 72.49,27.07 89.52,27.07 89.53,24.21 89.59,23.9 89.73,23.56 89.95,23.21 90.22,22.87 90.54,22.57 90.9,22.33 91.28,22.17
  pour Bottom (isolate 0.305): 91.67,22.11 91.74,22.11 95.86,22.11 95.86,5.64 84.38,5.64 84.13,5.6 83.81,5.47 83.45,5.27 83.09,5.01 82.75,4.68 82.47,4.3 82.28,3.87 82.21,3.4 82.21,2.41 68.44,2.41 68.44,0 4.14,0 4.14,3.6 4.08,3.9 3.92,4.23 3.66,4.56 3.34,4.89 2.95,5.18 2.53,5.42 2.09,5.58 1.63,5.64 -0.03,5.64 -0.03,13.82 2.56,13.84 2.79,13.96 2.95,14.15 3.05,14.39 3.08,14.65 3.05,14.91 2.95,15.15 2.79,15.34 2.56,15.45 -0.03,15.46 -0.03,19.29 2.56,19.29 3.11,19.36 3.58,19.56 3.96,19.87 4.27,20.25 4.51,20.7 4.67,21.17 4.77,21.65 4.8,22.11 4.8,25.9 14.97,25.9 14.95,25.69 25.08,25.79 25.28,27.9 71.68,27.9 72.49,27.07 89.52,27.07 89.53,24.21 89.59,23.9 89.73,23.56 89.95,23.21 90.22,22.87 90.54,22.57 90.9,22.33 91.28,22.17
LED1  (via drill 0.35)
  Top 0.254: 71.58,3.6 68.69,3.6 65.55,0.59 36.84,0.59 ICSP.2 | U1.17 84.43,17.29 86.05,16.59 v89.42,10.09 | v26.72,23.29 25.91,24.1 25.91,26.26 U$4.P$2
  Top 0.305: 71.58,3.6 v71.72,3.46
  Bottom 0.254: v71.72,3.46 72.22,2.87 80.07,2.87 81.74,4.57 82.64,5.47 82.85,5.68 83.38,6.28 87.45,6.28 89.42,8.4 v89.42,10.09 | v26.72,23.29 24.98,21.54 24.98,13.83 27.53,11.28 27.53,7.55 ICSP.2
LED2  (via drill 0.35)
  Top 0.254: v60.84,23.02 60.43,23.02 59.31,21.9 55.09,21.9 49.55,25.54 49.52,25.57 41.55,25.57 36.55,21.92 28.89,21.92 27.38,23.44 27.38,25.05 26.59,25.84 26.59,27.17 26.52,27.23 U$4.P$1
  Top 0.305: U1.26 78.41,19.01 78.41,18.9 v78.3,18.8
  Bottom 0.254: v78.3,18.8 74.56,22.54 65.67,22.54 65.5,22.38 64.78,22.38 64.49,22.77 61.27,22.75 60.98,22.97 60.89,22.97 v60.84,23.02
LM  (via drill 0.35)
  Top 0.254: U1.9 78.28,12.34 v78.28,12.6 | v66.5,11.35 66.5,11.38 62.81,15.07 v62.68,15.07 | v57.1,23.55 52.26,26.48 40.35,26.47 36.4,23.43 v36.4,23.4 | v16.97,15.71 16.97,14.56 17.68,13.85 27.28,13.88 v30.53,17.13
  Bottom 0.254: v78.28,12.6 77.98,12.6 76.72,11.35 v66.5,11.35 | v57.1,23.55 57.1,22.22 59.33,19.98 59.36,19.95 62.68,16.63 v62.68,15.07 | v36.4,23.4 30.61,18.88 v30.53,17.13
  Bottom 0.305: v16.97,15.71 18.44,17.18 19.16,17.18 19.36,16.98 20.78,16.98 20.78,19.34 19.76,20.35 U3.6
MOTOR+  (via drill 0.35)
  Top 0.406: U1.25 77.55,20.98 77.67,20.98 78.05,21.36 v78.43,21.36 | v81.72,24.24 81.72,24.56 82.47,25 R7.1
  Bottom 0.406: v78.43,21.36 79.2,21.36 80.15,22.31 v81.72,24.24
MOTOR-HEADER  (via drill 0.35)
  Top 0.406: v86.63,17.17 86.63,17.04 89.21,11.82 89.47,11.28 U$1.MOTOR | v85.9,25.01 R7.2
  Bottom 0.406: v85.9,25.01 85.9,17.9 v86.63,17.17
N$1
  Top 0.254: R1.2 76.28,8.72
  Top 0.305: 76.28,8.72 R2.2 78.92,9.71 81.23,9.71 Q1.1
N$2
  Top 0.254: U1.20 82.7,19.08 83.19,19.08 83.86,19.76 C6.2
N$3
  Top 0.254: Q2.1 71.55,23.64 R4.2 71.38,23.47 R3.2
N$4
  Top 0.254: U1.7 77.14,11.32 76.72,10.89 75.17,10.89 74.5,11.56 74.5,11.89 74.49,11.9 74.5,11.98 74.5,12.02 74.22,12.3 X1.IN
N$5
  Top 0.254: U$2.FT 20.65,24.27 TP1.P$1
N$6
  Top 0.254: U1.8 77.26,10.26 74.49,10.26 74.35,10.4 X1.OUT
N$7
  Bottom 0.305: S0.2 9.24,19.62 9.35,19.52 9.35,16.98 13.16,16.98 13.68,17.5 U3.1
N$8
  Bottom 0.305: S2.2 13.61,13.24 13.74,13.11 14.97,13.11 16,14.14 16,17.94 17.17,19.11 18.86,19.11 U3.7
N$9
  Top 0.254: U$4.P$4 28.32,25.4 R8.2
N$10
  Top 1.016: C2.2 13.97,10.68 U2.5
N$11
  Top 0.254: U$4.P$3 27.44,27.14 | 29.52,26.91 R11.2
  Top 0.508: 29.52,26.91 28.75,26.91 28.52,27.14 27.44,27.14
N$17
  pour Top: 31.5,16.35 41.47,22.53 41.99,22.82 42.72,23.03 43.6,23.16 44.56,23.21 45.54,23.18 46.47,23.05 47.29,22.84 47.93,22.53 58.02,16.23 58.38,15.9 58.62,15.51 58.74,15.07 58.76,14.61 58.68,14.16 58.53,13.73 58.31,13.34 58.04,13.03 49.76,7.76 48.69,7.05 47.55,6.51 46.35,6.16 45.1,5.99 43.82,6.03 42.51,6.28 41.18,6.75 39.84,7.45 31.2,12.93 30.81,13.23 30.52,13.62 30.35,14.06 30.3,14.55 30.38,15.04 30.6,15.52 30.97,15.97
N$19
  pour Bottom: 83.73,20.77 83.73,22.06 83.74,22.12 83.76,22.19 83.79,22.24 83.83,22.29 83.88,22.33 83.94,22.36 84,22.38 84.07,22.39 84.55,22.39 84.61,22.38 84.67,22.36 84.73,22.33 84.78,22.29 84.82,22.24 84.85,22.19 84.87,22.12 84.88,22.06 84.88,20.77 84.87,20.7 84.85,20.64 84.82,20.58 84.78,20.53 84.73,20.49 84.67,20.46 84.61,20.44 84.55,20.44 84.07,20.44 84,20.44 83.94,20.46 83.88,20.49 83.83,20.53 83.79,20.58 83.76,20.64 83.74,20.7
N$20
  pour Bottom: 87.16,20.53 88.45,20.53 88.52,20.52 88.58,20.5 88.64,20.47 88.69,20.43 88.73,20.38 88.76,20.32 88.78,20.26 88.78,20.19 88.78,19.71 88.78,19.65 88.76,19.59 88.73,19.53 88.69,19.48 88.64,19.44 88.58,19.41 88.52,19.39 88.45,19.38 87.16,19.38 87.1,19.39 87.03,19.41 86.98,19.44 86.93,19.48 86.89,19.53 86.86,19.59 86.84,19.65 86.83,19.71 86.83,20.19 86.84,20.26 86.86,20.32 86.89,20.38 86.93,20.43 86.98,20.47 87.03,20.5 87.1,20.52
N$21
  pour Bottom: 91.82,20.53 93.11,20.53 93.17,20.52 93.24,20.5 93.29,20.47 93.34,20.43 93.38,20.38 93.41,20.32 93.43,20.26 93.44,20.19 93.44,19.71 93.43,19.65 93.41,19.59 93.38,19.53 93.34,19.48 93.29,19.44 93.24,19.41 93.17,19.39 93.11,19.38 91.82,19.38 91.75,19.39 91.69,19.41 91.63,19.44 91.58,19.48 91.54,19.53 91.51,19.59 91.49,19.65 91.48,19.71 91.48,20.19 91.49,20.26 91.51,20.32 91.54,20.38 91.58,20.43 91.63,20.47 91.69,20.5 91.75,20.52
N$22
  pour Bottom: 78.33,25.71 79.62,25.71 79.69,25.7 79.75,25.68 79.81,25.65 79.86,25.61 79.9,25.56 79.93,25.5 79.95,25.44 79.95,25.37 79.95,24.9 79.95,24.83 79.93,24.77 79.9,24.71 79.86,24.66 79.81,24.62 79.75,24.59 79.69,24.57 79.62,24.56 78.33,24.56 78.26,24.57 78.2,24.59 78.15,24.62 78.1,24.66 78.06,24.71 78.03,24.77 78.01,24.83 78,24.9 78,25.37 78.01,25.44 78.03,25.5 78.06,25.56 78.1,25.61 78.15,25.65 78.2,25.68 78.26,25.7
N$23
  pour Bottom: 68.84,25.84 70.13,25.84 70.2,25.83 70.26,25.81 70.32,25.78 70.37,25.74 70.41,25.69 70.44,25.63 70.46,25.57 70.47,25.5 70.47,25.03 70.46,24.96 70.44,24.9 70.41,24.84 70.37,24.79 70.32,24.75 70.26,24.72 70.2,24.7 70.13,24.69 68.84,24.69 68.78,24.7 68.72,24.72 68.66,24.75 68.61,24.79 68.57,24.84 68.54,24.9 68.52,24.96 68.51,25.03 68.51,25.5 68.52,25.57 68.54,25.63 68.57,25.69 68.61,25.74 68.66,25.78 68.72,25.81 68.78,25.83
N$24
  pour Bottom: 64.93,25.84 66.22,25.84 66.28,25.83 66.34,25.81 66.4,25.78 66.45,25.74 66.49,25.69 66.52,25.63 66.54,25.57 66.55,25.5 66.55,25.03 66.54,24.96 66.52,24.9 66.49,24.84 66.45,24.79 66.4,24.75 66.34,24.72 66.28,24.7 66.22,24.69 64.93,24.69 64.86,24.7 64.8,24.72 64.74,24.75 64.69,24.79 64.65,24.84 64.62,24.9 64.6,24.96 64.59,25.03 64.59,25.5 64.6,25.57 64.62,25.63 64.65,25.69 64.69,25.74 64.74,25.78 64.8,25.81 64.86,25.83
N$25
  pour Bottom: 31.5,16.35 41.47,22.53 41.99,22.82 42.72,23.03 43.6,23.16 44.56,23.21 45.54,23.18 46.47,23.05 47.29,22.84 47.93,22.53 58.02,16.23 58.38,15.9 58.62,15.51 58.74,15.07 58.76,14.61 58.68,14.16 58.53,13.73 58.31,13.34 58.04,13.03 49.76,7.76 48.69,7.05 47.55,6.51 46.35,6.16 45.1,5.99 43.82,6.03 42.51,6.28 41.18,6.75 39.84,7.45 31.2,12.93 30.81,13.23 30.52,13.62 30.35,14.06 30.3,14.55 30.38,15.04 30.6,15.52 30.97,15.97
RST
  Top 0.254: 63.32,15.43 70.98,7.76 70.98,4.73 70.43,4.18 68.44,4.18 65.31,1.05 38.91,1.05 ICSP.3 | C7.2 69.14,20.43 70.41,20.43 70.74,20.76 73.63,20.76 74.97,19.43 74.97,19.05 U1.29
  Top 0.305: 63.32,15.43 63.32,16.14 | 63.32,16.14 63.32,18.29 62.64,18.97 62.64,24.48 R12.1 | 63.32,16.14 67.47,20.29 C7.2
RXD  (via drill 0.35)
  Top 0.254: v79.72,13.97 79.72,14.14 76.53,17.32 75.57,17.32 U1.30 | v30.51,2.48 29.35,1.2 8.72,1.19 8,1.91 8,4.86 6.65,6.21 3.81,6.21 2.44,7.57 1.73,7.57 1.29,8.01 1.29,10.98 3.27,12.95 8.82,12.95 9.17,13.3 9.21,13.3 | J1.4 10.03,15.25 10.03,14.12 9.21,13.3 | 9.08,13.17 9.21,13.3
  Bottom 0.305: v79.72,13.97 79.54,13.97 78.96,13.39 78.96,12.34 78.58,11.95 77.96,11.95 77.54,11.53 76.67,10.64 69.9,10.64 61.69,2.43 30.55,2.43 v30.51,2.48
S1  (via drill 0.35)
  Top 0.203: TP4.P$1 55.96,6.76 50.23,6.76 49.33,6.17 49.33,5.88 52.76,2.45 64.19,2.45 64.49,2.75 v64.49,3.01
  Top 0.254: ICSP.1 27.35,7.68 31.77,7.68 40.86,1.46 65.07,1.46 67.77,4.15 v67.77,5.55
  Top 0.305: U1.16 84.47,15.45 85.36,15.45 v85.74,15.07
  Top 0.406: v87.8,18.59 88.64,18.59 89.4,19.36 89.4,20.6 88.77,21.23 S1+.P$1
  Bottom 0.254: v85.74,15.07 87.01,15.07 87.8,15.86 v87.8,18.59 | v67.77,5.55 65.23,3.01 v64.49,3.01
  Bottom 0.305: v85.74,15.07 78.17,7.57 69.77,7.55 v67.77,5.55
S3
  Top 0.305: U1.12 82.44,11.58 85.62,11.58 88.19,7.69 91.72,7.69 U$1.S3
S5
  Top 0.254: U1.11 81.03,11.89
  Top 0.305: 81.03,11.89 81.87,10.98 85.14,10.98 87.74,6.87 U$1.S5
S8@2.5V  (via drill 0.35)
  Top 0.254: U1.24 79.26,19.99 v78.89,17.67 | 25.11,20.9 R10.1 25.09,20.24 25.59,19.75 v26.28,19.75 | v65.38,21.7 63.95,20.28 63.83,20.37 v63.9,20.3
  Top 0.305: R9.2 23.04,20.09 24.78,20.09 25.11,20.42 25.11,20.9
  Bottom 0.254: v78.89,17.67 78.59,17.67 76.09,19.97 74.26,19.98 72.05,22.13 65.88,22.13 65.43,21.75 v65.38,21.7 | 31.78,25.43 26.28,19.93 v26.28,19.75 | v63.9,20.3 63.49,20.66
  Bottom 0.305: 63.49,20.66 60.5,20.65 58.73,22.72 58.7,23.98 57.1,25.28 31.78,25.43
S8@6V  (via drill 0.35)
  Top 0.254: R9.1 34.59,19.08 34.94,19.11 38.34,21.28 42.36,23.91 48.13,23.87 59.93,15.91 60.34,15.91 69.08,7.17 | 69.08,7.17 | 69.08,7.17 69.08,7.09 69.54,6.64 69.54,5.19 v69.13,4.78
  Top 1.016: v90.02,17.08 90.02,16.98 89.83,16.79 89.4,16.79 88.91,16.31 U$1.S8
  Bottom 0.305: v90.02,17.08 90.02,15.92 86.23,12.14 86.23,9.55 85.6,9 85.57,8.98 82.1,8.98 78.79,5.74 73.83,5.8 73.08,6.67 70.66,6.67 70.57,6.66 69.13,5.27 v69.13,4.78
S9@2.5V  (via drill 0.35)
  Top 0.254: R5.2 20.52,16.28 22.49,16.28 22.88,16.66 22.88,17.17 | v79.8,17.1 79.7,19.45 U1.23 | v64.57,19.64 64.57,19.92 66.17,21.52 v66.19,21.52
  Top 0.305: v26.44,16.88 26,16.45 23.65,16.45 R6.1 22.88,17.17
  Bottom 0.254: v79.8,17.1 79.44,16.75 78.88,16.75 76.3,19.03 74.44,19.03 71.95,21.52 v66.19,21.52 | 32.19,24.71 26.44,18.95 v26.44,16.88 | v64.57,19.64 63.65,19.64 63.14,20.15 62.06,20.15
  Bottom 0.305: 62.06,20.15 62.02,20.2 60.12,20.19 58.01,22.26 57.97,23.61 56.91,24.73 32.19,24.71
S9@6V  (via drill 0.35)
  Top 0.254: v62.01,16.27 v62.02,16.27 62.02,14.84 70.08,6.74 70.08,5.2 v70.21,5.2
  Top 0.305: v26.59,15.41 21.18,15.41 R5.1
  Top 1.016: U$1.S9 v92.02,16.53
  Bottom 0.254: v26.59,15.41 27.4,16.22 27.4,18.81 32.85,24.25 56.25,24.29 56.33,22.15 62.01,16.47 v62.01,16.27
  Bottom 0.305: v92.02,16.53 86.98,11.48 86.98,9.01 86.27,8.3 86.2,8.28 82.5,8.28 79.2,5.16 73.57,5.16 73.35,5.42 72.83,5.98 70.94,5.98 70.21,5.26 v70.21,5.2
SDA_S2  (via drill 0.35)
  Top 0.254: v63.92,23.88 64.25,24.21 66.27,24.21 67.74,22.74 74.65,22.74 75.13,22.26 75.13,21.15 U1.27 | J1.2 11.05,18.68 13.33,20.96 v16.51,20.96
  Top 0.305: S2+.P$1 64.51,26.55 63.92,25.87 v63.92,23.88
  Bottom 0.254: v63.92,23.88 61.92,23.88 61.18,24.62 58.93,24.62 57.53,25.88 30.14,25.88 28.23,24.1 26.04,24.1 22.91,20.96 v16.51,20.96
SOL1
  Top 0.254: U1.1 72.46,13.37 70.76,13.36 70.76,10.07 72.18,8.65 74.38,8.65
  Top 0.305: 74.38,8.65 R1.1
SOL1-
  Top 0.254: 81.97,5.82 D1.A
  Top 0.813: Q1.3 83.59,7.51 82.81,5.82 81.97,5.82 80.04,5.82 79.96,5.79 SOL1.SOL1-
SOL2  (via drill 0.35)
  Top 0.254: v28.33,23.34 29.15,22.52 36.37,22.51 40.93,25.98 50.17,25.99 55.43,22.68 58.98,22.65 v60.04,23.71 | v65.15,23.24 66.38,23.24 67.67,21.95 R3.1
  Top 0.406: v82.97,15.74 82.53,14.91 U1.15
  Bottom 0.254: v82.97,15.74 82.35,15.74 75.01,22.95 65.35,22.96 65.15,23.16 v65.15,23.24 65.12,23.21 61.84,23.21 61.34,23.71 60.02,23.71 v60.04,23.71 | ICSP.5 28.71,11.01 25.6,14.12 25.6,20.61 v28.33,23.34
SOL2-
  Top 0.813: SOL2-.P$1 78.21,26.27 arc90 77.42,25.48 | 77.42,25.48 77.42,24.09 76.49,23.16 Q2.3 | D2.A 77.42,25.74 77.42,25.48
TCS3200_OE  (via drill 0.35)
  Top 0.305: U1.13 81.63,13.52 81.12,13.52 78.27,16.62 v78.1,16.62 | v49.1,4.1 49.02,4.05 41.35,4.02 31.31,10.65 20.2,10.69 18.74,12.15 15.77,12.15 v15.54,12.38
  Bottom 0.254: v15.54,12.38 15.37,12.2 11.81,12.2 6.27,17.74 6.27,22.59 7.75,24.34
  Bottom 0.305: v78.1,16.62 74.12,12.63 61.89,12.63 49.15,4.1 v49.1,4.1 | U3.3 14.35,21.02 14.91,21.02 15.09,21.2 15.09,22.05 14.43,22.71 14.43,23.33 13.41,24.34 7.75,24.34
TCS3200_S1  (via drill 0.35)
  Top 0.254: U1.32 73.8,16.55 74.61,15.73 74.76,15.87 74.75,15.85 v74.75,15.68 | v15.57,19.11 18.36,19.11 19.23,18.24 27.15,18.18 28.56,17.05 v28.7,17.08
  Bottom 0.254: v74.75,15.68 74.75,15.43 72.95,13.62 72.52,13.24 61.62,13.27 56.37,9.64 49.43,5.16 41.2,5.16 28.62,13.61 v28.7,17.08
  Bottom 0.305: v15.57,19.11 13.7,19.11 U3.2
TCS3200_S3  (via drill 0.35)
  Top 0.254: 49.83,4.73 41.73,4.73 31.59,11.29 31.59,11.31 25.37,11.31 23.57,13.12 17.15,13.1 16.23,13.98 16.23,16.85 v17.16,17.78
  Top 0.305: U1.10 79.66,12.1 79.65,12.1 79.65,12.99 v79.63,13.01 | 49.83,4.73 52.64,1.93 64.88,1.93 67.11,4.15 67.11,6.16 67.84,6.89 v68.12,6.89
  Bottom 0.305: v79.63,13.01 79.64,13 79.64,12.11 79,11.47 78.39,11.47 75,8.09 69.65,8.09 69.35,8.08 68.24,6.89 v68.12,6.89 | v17.16,17.78 17.19,17.81 U3.8
TXD  (via drill 0.35)
  Top 0.254: v24.88,12.73 25.73,11.93 31.51,12.01 42.03,5.35 47.37,5.37 59.93,13.67 v60.12,13.67 | U1.31 74.28,17.45 74.21,17.48 | J1.5 9.55,14.59 8.83,13.86 v8.85,13.84
  Top 0.305: 74.21,17.48 73.93,17.9 73.34,17.83 v72.53,16.94
  Bottom 0.254: v72.53,16.94 71.68,16.01 69.5,16.01 67.8,14.4 67.12,13.76 63.32,13.76 60.26,13.76 v60.12,13.67 | v8.85,13.84 13.33,9.36 21.41,9.36 24.78,12.73 v24.88,12.73

### Text on the board
Top: top
Bottom: bottom
Dimension: CUT OUT | CUT OUT | CUT OUT | CUT OUT | CUT OUT | CUT OUT | CUT OUT | CUT OUT
tPlace: S2+ | S2- | 20200625 | C | F+ | FF | F- | layout 7.9C | SOL2- | TP-FT | S1+ | SOL2+ | S1- | DTR | TXD | RXD | VCC | GND | S8 | S9 | FTDI | 1W | VCC-6V | MOTOR | X1 | 3.3V | VCC | MOSI | GND | GND | 3.3V | S3 | GND | Q1 | S5 | 6V | C | MISO | SCK | RST | 6V | MEROË C / TCS3200 | SOL1+ | SOL1-
bPlace: www.openSX70.com | layout 9.0 | 1 | LIGHT / METER | VCC | MOSI | GND | ICSP / BOTTOM | MISO | SCK | RST | MEROË-C
tNames: A+ | LED | USB-FTDI | + | U1 | + | + | +
tDocu: Creative Commons "Attribution-NonCommercial 4.0 International (CC BY-NC 4.0)" / https://creativecommons.org/licenses/by-nc/4.0/ | ALL VIAS TENTED | FLAT / CABLE | openSX70 project visit www.openSX70.com / version 7.9C "MEROË-C" 20200625 / PCB MUST BE .6mm!!! / by Joaquín de Prada